# Altium schematic sheet 15_PMU.SchDoc: MIZ7035_16_PMU
size A3; Revision: V1.0; SheetNumber: 15; SheetTotal: 17
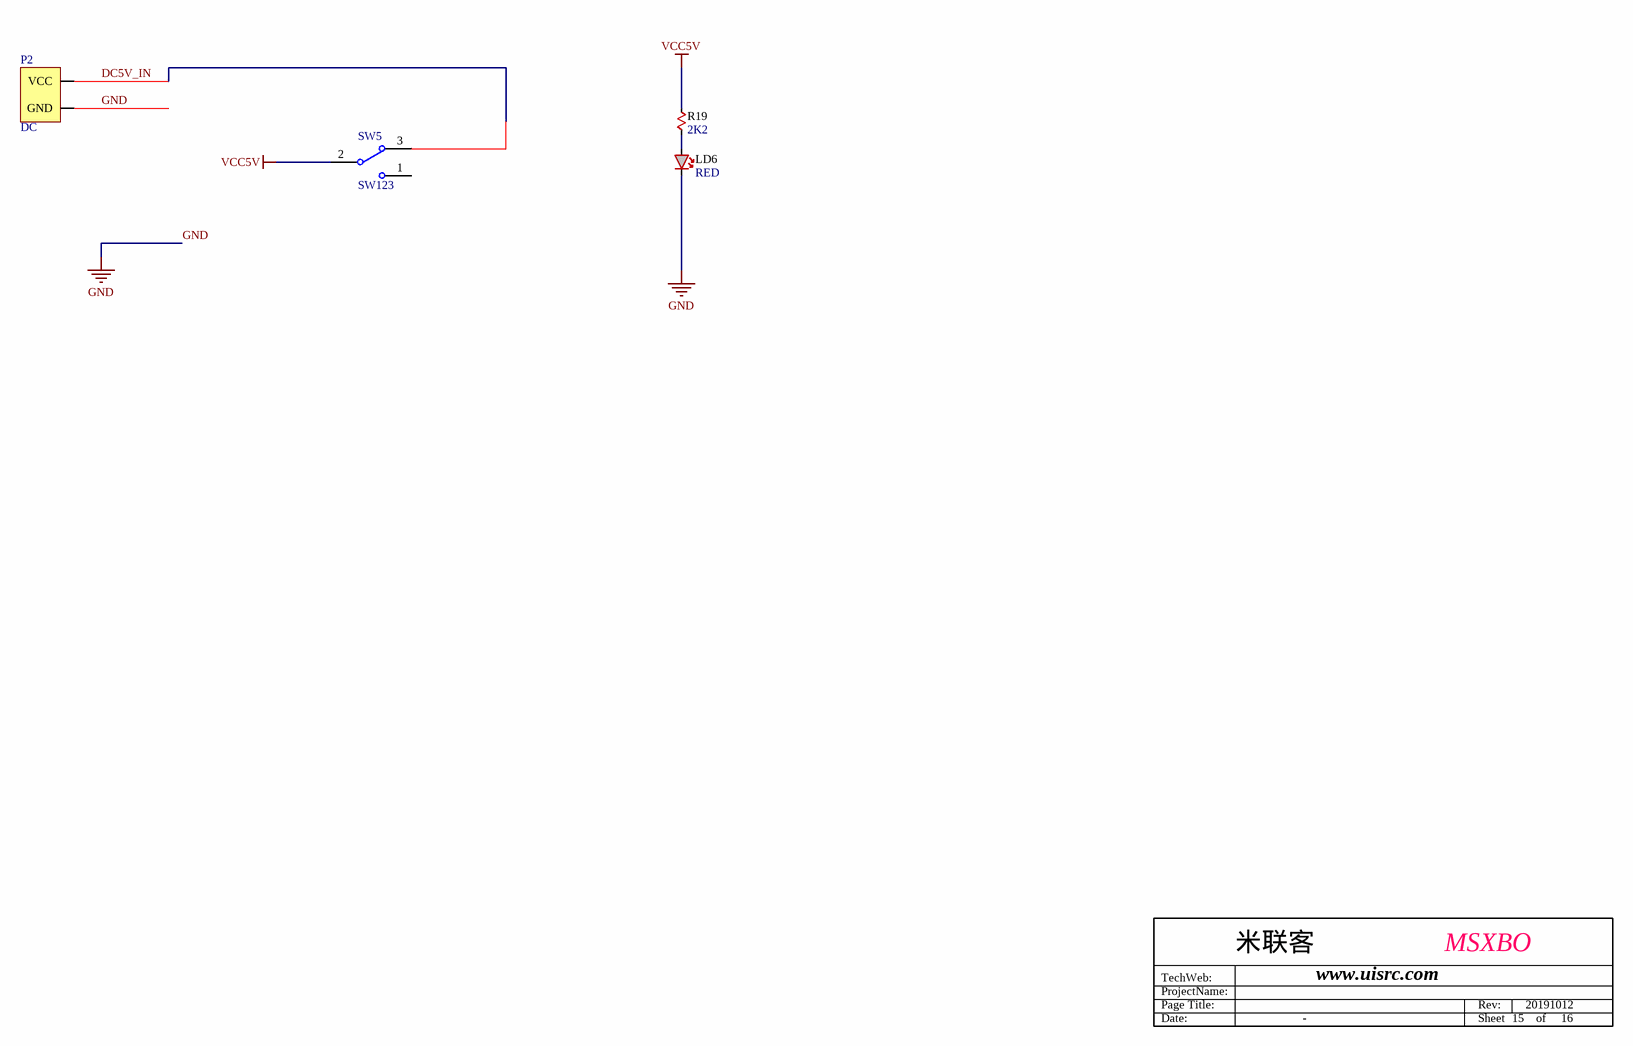
[diagram p0: 15_PMU.SchDoc]

## Parts
LD6  value RED  [D0603]  (hidden comment: LED)
P2  DC  [DC5.0]
R19  2K2  [R0603]
SW5  SW123  [SW1-2-3 -B]

## Nets
GND: LD6.K P2.2(GND)
VCC5V: R19.1 SW5.2
DC5V_IN: P2.1(VCC) SW5.3
NetLD6_A: LD6.A R19.2

Not connected (* = marked no-connect by the designer): SW5 1

## Notes on the sheet
- ProjectName:
- TechWeb:
- Page Title:
- 米联客
- www.uisrc.com
- MSXBO
- Rev:
- 20191012
- Date:
- -
- Sheet
- 15    of     16
- Title
- Size:
- A3
- Number:
- Time:
- Revision:
- of
- File:

## Library data of the parts
LD6 = LED: Generic LED; Manufacturer: *; DPN: *
R19 = RESISTOR: Generic Resistor; Value: 390; Manufacturer: *; DPN: *